# Altium project VENTUNOQ.PrjPcb (part 9 of 18)

## Sheet POWER_DCDC_SOM.SchDoc: POWER DCDC SOM
size A3; Author: Silvio Navaretti; CompanyName: ARDUINO; DrawnBy: Silvio Navaretti; Engineer: Silvio Navaretti; Organization: ARDUINO; SheetNumber: 39; SheetTotal: 51; RevAuthor: Silvio Navaretti
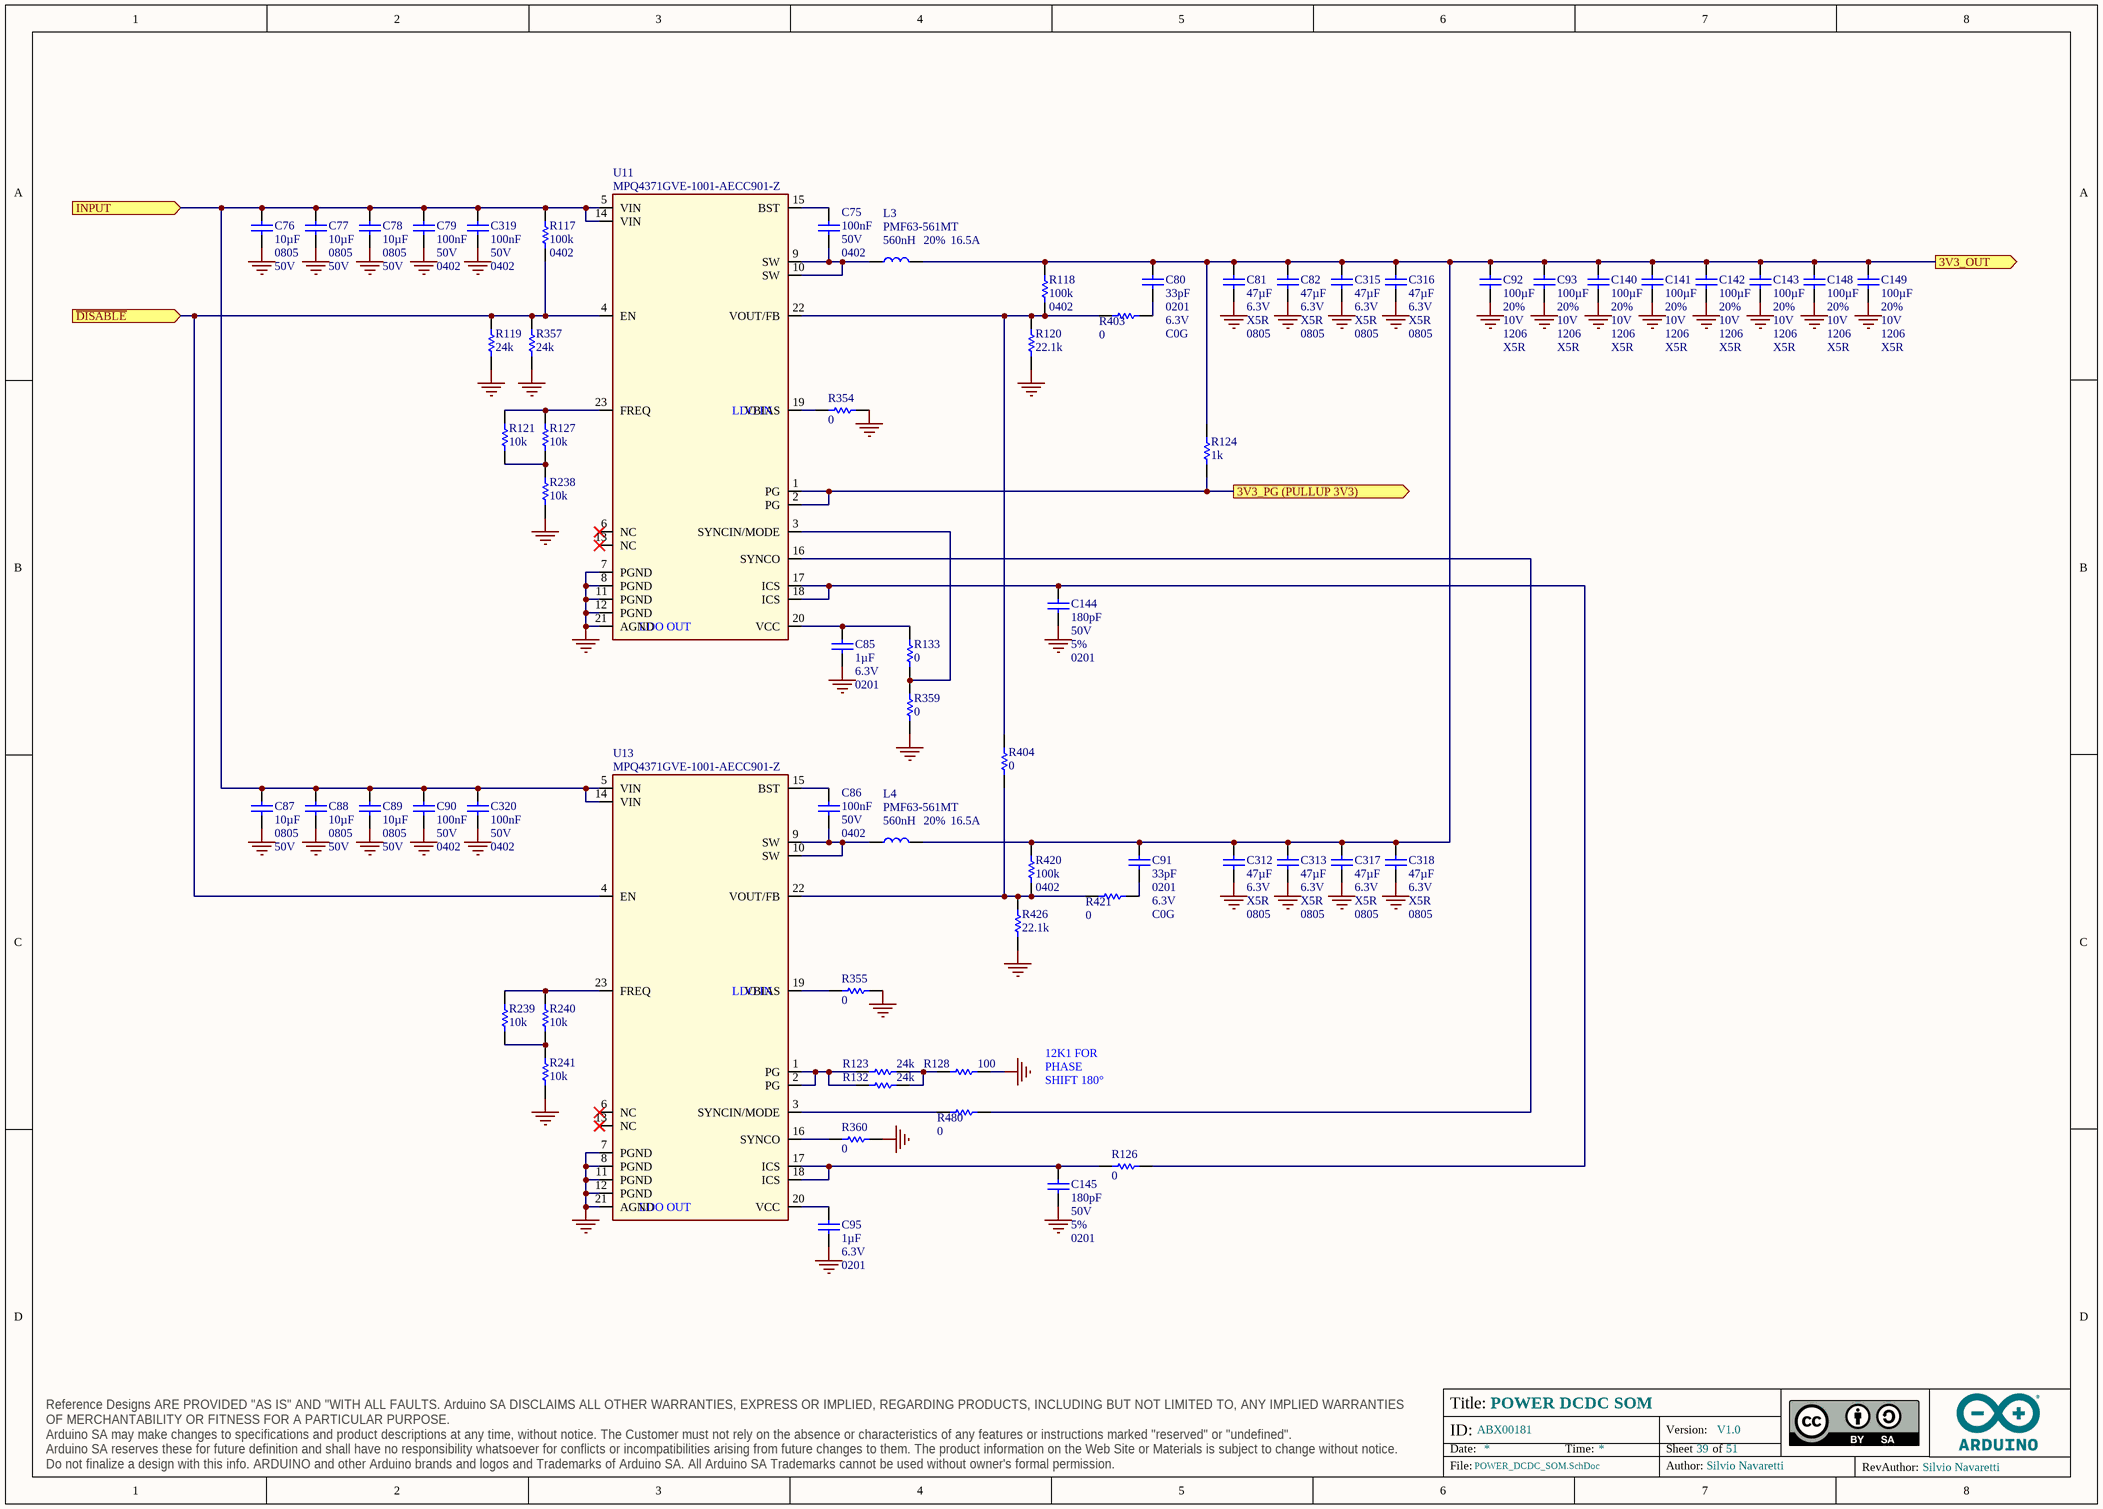
[diagram p23: POWER_DCDC_SOM.SchDoc]

### Parts
C75  value 100nF  Voltage: 50V  Case Code (Imperial): 0402  [CAP-0402]  (hidden comment: GRM155R61H104KE19D)
C76  value 10µF  Case Code (Imperial): 0805  Voltage: 50V  [CAP-0805]  (hidden comment: GRM21BR61H106ME43L)
C77  value 10µF  Case Code (Imperial): 0805  Voltage: 50V  [CAP-0805]  (hidden comment: GRM21BR61H106ME43L)
C78  value 10µF  Case Code (Imperial): 0805  Voltage: 50V  [CAP-0805]  (hidden comment: GRM21BR61H106ME43L)
C79  value 100nF  Voltage: 50V  Case Code (Imperial): 0402  [CAP-0402]  (hidden comment: GRM155R61H104KE19D)
C80  value 33pF  Case Code (Imperial): 0201  Voltage: 6.3V  Dielectric: C0G  [CAP-0201]  (hidden comment: GJM0335C0J330JB01J)
C81  value 47µF  Voltage: 6.3V  Dielectric: X5R  Case Code (Imperial): 0805  [CAP-0805]  (hidden comment: C0805C476M9PAC7800)
C82  value 47µF  Voltage: 6.3V  Dielectric: X5R  Case Code (Imperial): 0805  [CAP-0805]  (hidden comment: C0805C476M9PAC7800)
C85  value 1µF  Voltage: 6.3V  Case Code (Imperial): 0201  [CAP-0201]  (hidden comment: GRM033R60J105MEA2D)
C86  value 100nF  Voltage: 50V  Case Code (Imperial): 0402  [CAP-0402]  (hidden comment: GRM155R61H104KE19D)
C87  value 10µF  Case Code (Imperial): 0805  Voltage: 50V  [CAP-0805]  (hidden comment: GRM21BR61H106ME43L)
C88  value 10µF  Case Code (Imperial): 0805  Voltage: 50V  [CAP-0805]  (hidden comment: GRM21BR61H106ME43L)
C89  value 10µF  Case Code (Imperial): 0805  Voltage: 50V  [CAP-0805]  (hidden comment: GRM21BR61H106ME43L)
C90  value 100nF  Voltage: 50V  Case Code (Imperial): 0402  [CAP-0402]  (hidden comment: GRM155R61H104KE19D)
C91  value 33pF  Case Code (Imperial): 0201  Voltage: 6.3V  Dielectric: C0G  [CAP-0201]  (hidden comment: GJM0335C0J330JB01J)
C92  value 100µF  Tolerance: 20%  Voltage: 10V  Case Code (Imperial): 1206  Dielectric: X5R  [CAP-1206]  (hidden comment: GRM31CR61A107MEA8L)
C93  value 100µF  Tolerance: 20%  Voltage: 10V  Case Code (Imperial): 1206  Dielectric: X5R  [CAP-1206]  (hidden comment: GRM31CR61A107MEA8L)
C95  value 1µF  Voltage: 6.3V  Case Code (Imperial): 0201  [CAP-0201]  (hidden comment: GRM033R60J105MEA2D)
C140  value 100µF  Tolerance: 20%  Voltage: 10V  Case Code (Imperial): 1206  Dielectric: X5R  [CAP-1206]  (hidden comment: GRM31CR61A107MEA8L)
C141  value 100µF  Tolerance: 20%  Voltage: 10V  Case Code (Imperial): 1206  Dielectric: X5R  [CAP-1206]  (hidden comment: GRM31CR61A107MEA8L)
C142  value 100µF  Tolerance: 20%  Voltage: 10V  Case Code (Imperial): 1206  Dielectric: X5R  [CAP-1206]  (hidden comment: GRM31CR61A107MEA8L)
C143  value 100µF  Tolerance: 20%  Voltage: 10V  Case Code (Imperial): 1206  Dielectric: X5R  [CAP-1206]  (hidden comment: GRM31CR61A107MEA8L)
C144  value 180pF  Voltage: 50V  Tolerance: 5%  Case Code (Imperial): 0201  [CAP-0201]  (hidden comment: GRM0335C1H181JA01D)
C145  value 180pF  Voltage: 50V  Tolerance: 5%  Case Code (Imperial): 0201  [CAP-0201]  (hidden comment: GRM0335C1H181JA01D)
C148  value 100µF  Tolerance: 20%  Voltage: 10V  Case Code (Imperial): 1206  Dielectric: X5R  [CAP-1206]  (hidden comment: GRM31CR61A107MEA8L)
C149  value 100µF  Tolerance: 20%  Voltage: 10V  Case Code (Imperial): 1206  Dielectric: X5R  [CAP-1206]  (hidden comment: GRM31CR61A107MEA8L)
C312  value 47µF  Voltage: 6.3V  Dielectric: X5R  Case Code (Imperial): 0805  [CAP-0805]  (hidden comment: C0805C476M9PAC7800)
C313  value 47µF  Voltage: 6.3V  Dielectric: X5R  Case Code (Imperial): 0805  [CAP-0805]  (hidden comment: C0805C476M9PAC7800)
C315  value 47µF  Voltage: 6.3V  Dielectric: X5R  Case Code (Imperial): 0805  [CAP-0805]  (hidden comment: C0805C476M9PAC7800)
C316  value 47µF  Voltage: 6.3V  Dielectric: X5R  Case Code (Imperial): 0805  [CAP-0805]  (hidden comment: C0805C476M9PAC7800)
C317  value 47µF  Voltage: 6.3V  Dielectric: X5R  Case Code (Imperial): 0805  [CAP-0805]  (hidden comment: C0805C476M9PAC7800)
C318  value 47µF  Voltage: 6.3V  Dielectric: X5R  Case Code (Imperial): 0805  [CAP-0805]  (hidden comment: C0805C476M9PAC7800)
C319  value 100nF  Voltage: 50V  Case Code (Imperial): 0402  [CAP-0402]  (hidden comment: GRM155R61H104KE19D)
C320  value 100nF  Voltage: 50V  Case Code (Imperial): 0402  [CAP-0402]  (hidden comment: GRM155R61H104KE19D)
L3  PMF63-561MT  Inductance: 560nH  IRMS: 16.5A  Tolerance: 20%  [PMF63]
L4  PMF63-561MT  Inductance: 560nH  IRMS: 16.5A  Tolerance: 20%  [PMF63]
R117  value 100k  Case Code (Imperial): 0402  [RES-0402]  (hidden comment: CRCW0402100KFKEDC)
R118  value 100k  Case Code (Imperial): 0402  [RES-0402]  (hidden comment: CRCW0402100KFKEDC)
R119  value 24k  [RES-0201]  (hidden comment: RC0201FR-0724KL)
R120  value 22.1k  [RES-0201]  (hidden comment: RC0201FR-0722K1L)
R121  value 10k  [RES-0201]  (hidden comment: RC0201FR-0710KL)
R123  value 24k  [RES-0201]  (hidden comment: RC0201FR-0724KL)
R124  value 1k  [RES-0201]  (hidden comment: RC0201FR-071KL)
R126  value 0  [RES-0201]  (hidden comment: CRCW02010000Z0ED)
R127  value 10k  [RES-0201]  (hidden comment: RC0201FR-0710KL)
R128  value 100  [RES-0201]  (hidden comment: RC0201FR-07100RL)
R132  value 24k  [RES-0201]  (hidden comment: RC0201FR-0724KL)
R133  value 0  [RES-0201]  (hidden comment: CRCW02010000Z0ED)
R238  value 10k  [RES-0201]  (hidden comment: RC0201FR-0710KL)
R239  value 10k  [RES-0201]  (hidden comment: RC0201FR-0710KL)
R240  value 10k  [RES-0201]  (hidden comment: RC0201FR-0710KL)
R241  value 10k  [RES-0201]  (hidden comment: RC0201FR-0710KL)
R354  value 0  [RES-0201]  (hidden comment: CRCW02010000Z0ED)
R355  value 0  [RES-0201]  (hidden comment: CRCW02010000Z0ED)
R357  value 24k  [RES-0201]  (hidden comment: RC0201FR-0724KL)
R359  value 0  [RES-0201]  (hidden comment: CRCW02010000Z0ED)
R360  value 0  [RES-0201]  (hidden comment: CRCW02010000Z0ED)
R403  value 0  [RES-0201]  (hidden comment: CRCW02010000Z0ED)
R404  value 0  [RES-0201]  (hidden comment: CRCW02010000Z0ED)
R420  value 100k  Case Code (Imperial): 0402  [RES-0402]  (hidden comment: CRCW0402100KFKEDC)
R421  value 0  [RES-0201]  (hidden comment: CRCW02010000Z0ED)
R426  value 22.1k  [RES-0201]  (hidden comment: RC0201FR-0722K1L)
R480  value 0  [RES-0201]  (hidden comment: CRCW02010000Z0ED)
U11  MPQ4371GVE-1001-AECC901-Z  [MPQ4371GVE-1001-AECC901-Z]
U13  MPQ4371GVE-1001-AECC901-Z  [MPQ4371GVE-1001-AECC901-Z]

### Ports
3V3_OUT (out), 3V3_PG (PULLUP 3V3) (out), INPUT (in), ~{DISABLE} (in)

### Nets
+3V3: C80.2 C81.2 C82.2 C91.2 C92.1 C93.1 C140.1 C141.1 C142.1 C143.1 C148.1 C149.1 C312.2 C313.2 C315.2 C316.2 C317.2 C318.2 L3.2 L4.2 R118.1 R124.1 R420.1 ; port 3V3_OUT
GND: C76.2 C77.2 C78.2 C79.2 C81.1 C82.1 C85.1 C87.2 C88.2 C89.2 C90.2 C92.2 C93.2 C95.1 C140.2 C141.2 C142.2 C143.2 C144.1 C145.1 C148.2 C149.2 C312.1 C313.1 C315.1 C316.1 C317.1 C318.1 C319.2 C320.2 R119.1 R120.1 R128.2 R238.1 R241.1 R354.1 R355.1 R357.1 R359.1 R360.1 R426.1 U11.7(PGND) U11.8(PGND) U11.11(PGND) U11.12(PGND) U11.21(AGND) U13.7(PGND) U13.8(PGND) U13.11(PGND) U13.12(PGND) U13.21(AGND)
3V3_PG (PULLUP 3V3): R124.2 U11.1(PG) U11.2(PG) ; port 3V3_PG (PULLUP 3V3)
~{POWER_DISABLE_7-24V}: R117.2 R119.2 R357.2 U11.4(EN) U13.4(EN) ; port ~{DISABLE}
NetC75_1: C75.1 U11.15(BST)
NetC75_2: C75.2 L3.1 U11.9(SW) U11.10(SW)
NetC76_1: C76.1 C77.1 C78.1 C79.1 C87.1 C88.1 C89.1 C90.1 C319.1 C320.1 R117.1 U11.5(VIN) U11.14(VIN) U13.5(VIN) U13.14(VIN) ; port INPUT
NetC80_1: C80.1 R403.2
NetC85_2: C85.2 R133.2 U11.20(VCC)
NetC86_1: C86.1 U13.15(BST)
NetC86_2: C86.2 L4.1 U13.9(SW) U13.10(SW)
NetC91_1: C91.1 R421.2
NetC95_2: C95.2 U13.20(VCC)
NetC144_2: C144.2 R126.1 U11.17(ICS) U11.18(ICS)
NetC145_2: C145.2 R126.2 U13.17(ICS) U13.18(ICS)
NetR118_2: R118.2 R120.2 R403.1 R404.1 U11.22(VOUT/FB)
NetR121_1: R121.1 R127.1 R238.2
NetR121_2: R121.2 R127.2 U11.23(FREQ)
NetR123_1: R123.1 R128.1 R132.1
NetR123_2: R123.2 R132.2 U13.1(PG) U13.2(PG)
NetR133_1: R133.1 R359.2 U11.3(SYNCIN/MODE)
NetR239_1: R239.1 R240.1 R241.2
NetR239_2: R239.2 R240.2 U13.23(FREQ)
NetR354_2: R354.2 U11.19(VBIAS)
NetR355_2: R355.2 U13.19(VBIAS)
NetR360_2: R360.2 U13.16(SYNCO)
NetR404_2: R404.2 R420.2 R421.1 R426.2 U13.22(VOUT/FB)
NetR480_1: R480.1 U13.3(SYNCIN/MODE)
NetR480_2: R480.2 U11.16(SYNCO)

Not connected (* = marked no-connect by the designer): U11 6(NC)* 13(NC)*; U13 6(NC)* 13(NC)*

### Notes on the sheet
- 12K1 FOR PHASE SHIFT 180°
- Title:
- ID:
- Date:
- Time:
- Version:
- Sheet
- of
- RevAuthor:
- Reference Designs ARE PROVIDED "AS IS" AND "WITH ALL FAULTS. Arduino SA DISCLAIMS ALL OTHER WARRANTIES, EXPRESS OR IMPLIED, REGARDING PRODUCTS, INCLUDING BUT NOT LIMITED TO, ANY IMPLIED WARRANTIES OF MERCHANTABILITY OR FITNESS FOR A PARTICULAR PURPOSE.
  Arduino SA may make changes to specifications and product descriptions at any time, without notice. The Customer must not rely on the absence or characteristics of any features or instructions marked "reserved" or "undefined".
  Arduino SA reserves these for future definition and shall have no responsibility whatsoever for conflicts or incompatibilities arising from future changes to them. The product information on the Web Site or Materials is subject to change without notice.
  Do not finalize a design with this info. ARDUINO and other Arduino brands and logos and Trademarks of Arduino SA. All Arduino SA Trademarks cannot be used without owner's formal permission.
- File:
- Author:
- (in symbol U0503-A.7) LDO IN; LDO OUT

### Library data of the parts
C75 C79 C86 C90 C319 C320 = C0015-A.14: as C301 on sheet POWER; Part Number: GRM155R61H104KE19D; Dielectric: X5R; Tolerance: 10%; Technology: Ceramic
C76-C78 C87-C89 = C0158-A.3: as C73 on sheet ETH_PHY; Tolerance: 20%; Dielectric: X5R; Technology: SMD; Part Number: GRM21BR61H106ME43L
C80 C91 = C0114-A.6: CAP CHIP 0201 33pF 5% 6.3V C0G; Manufacturer: Murata Electronics; Code Arduino: C0114; Technology: Ceramic; Tolerance: 5%; Part Number: GJM0335C0J330JB01J
C81 C82 C312 C313 C315-C318 = C0199-A.1: as C221 on sheet POWER; Technology: Ceramic; Tolerance: 20%; Part Number: C0805C476M9PAC7800
C85 C95 = C0002-A.15: as C9 on sheet ETH_PHY; Tolerance: 20%; Dielectric: X5R; Part Number: GRM033R60J105MEA2D; Technology: Ceramic
C92 C93 C140-C143 C148 C149 = C0166-A.1: CAP CHIP 1206 100uF 20% 10V X5R; Manufacturer: Murata; Code Arduino: C0166; Datasheet: https://www.mouser.it/datasheet/2/281/1/GRM31CR61A107MEA8_01A-1987899.pdf; Technology: Thick film; Part Number: GRM31CR61A107MEA8L
C144 C145 = C0198-A.1: CAP CHIP 0201 180pF 5% 50V C0G; Manufacturer: Murata; Code Arduino: C0198; Technology: Ceramic; Dielectric: C0G; Part Number: GRM0335C1H181JA01D
L3 L4 = I0124-A.1: IND 0.56uH 20%, max 5mR, IRMS 16.5A, Isat 25.5A, 7.3x6.6x3mm; Manufacturer: K-WELL; Code Arduino: I0124; DCR max: 5m; ISAT: 25.5A; Part Number: PMF63-561MT; Case Code (Metric): 7.3x6.6x3mm; Max Operating Temperature: 125°C; ComponentLink1URL: http://www.kw-magnetics.com/index.php?m=content&c=index&a=show&catid=162&id=294
R117 R118 R420 = R0001-A.24: as R230 on sheet POWER; Tolerance: 1%; Part Number: CRCW0402100KFKEDC; Technology: Thick film
R119 R123 R132 R357 = R0398-A.1: as R248 on sheet POWER; Technology: Thick film; Tolerance: 1%; Case Code (Imperial): 0201; Part Number: RC0201FR-0724KL
R120 R426 = R0396-A.1: RES CHIP 0201 22k1 1% 1/20W; Manufacturer: YAGEO; Code Arduino: R0396; Temperature Coefficient: 200ppm; Power: 50mW; Part Number: RC0201FR-0722K1L; Tolerance: 1%; Technology: Thick film; Case Code (Imperial): 0201
R121 R127 R238-R241 = R0145-A.21: as R150 on sheet POWER; Manufacturer 2: Samsung Electro-Mechanics; Tolerance: 1%; Case Code (Imperial): 0201; Part Number: RC0201FR-0710KL; Technology: Thick film
R124 = R0195-A.22: RES CHIP 0201 1k 1% 1/20W; Manufacturer: Yageo; Power: 50mW; Temperature coefficient: 200ppm; Code Arduino: R0195; Tolerance: 1%; Case Code (Imperial): 0201; Part Number: RC0201FR-071KL; Technology: Thick film
R126 R133 R354 R355 R359 R360 R403 R404 R421 R480 = R0140-A.21: as R284 on sheet ETH_PHY; Technology: Thick film; Case Code (Imperial): 0201; Part Number: CRCW02010000Z0ED
R128 = R0235-A.13: RES CHIP 0201 100R 1% 1/20W; Manufacturer: YAGEO; Power: 50mW; Temperature coefficient: 200ppm; Code Arduino: R0235; Tolerance: 1%; Case Code (Imperial): 0201; Technology: Thick film; Part Number: RC0201FR-07100RL
U11 U13 = U0503-A.7: IC Buck Vin 36V, Vout ADJ, Iout max 11A, with FSS, multi phase, QFN23 4x5mm; Manufacturer: MPS; Code Arduino: U0503; Part Number: MPQ4371GVE-1001-AECC901-Z

## Sheet POWER_REGULATORS_CARRIER.SchDoc: POWER REGULATORS
size A3; Author: Silvio Navaretti; CompanyName: ARDUINO; DrawnBy: Silvio Navaretti; Engineer: Silvio Navaretti; Organization: ARDUINO; SheetNumber: 40; SheetTotal: 51; RevAuthor: Silvio Navaretti
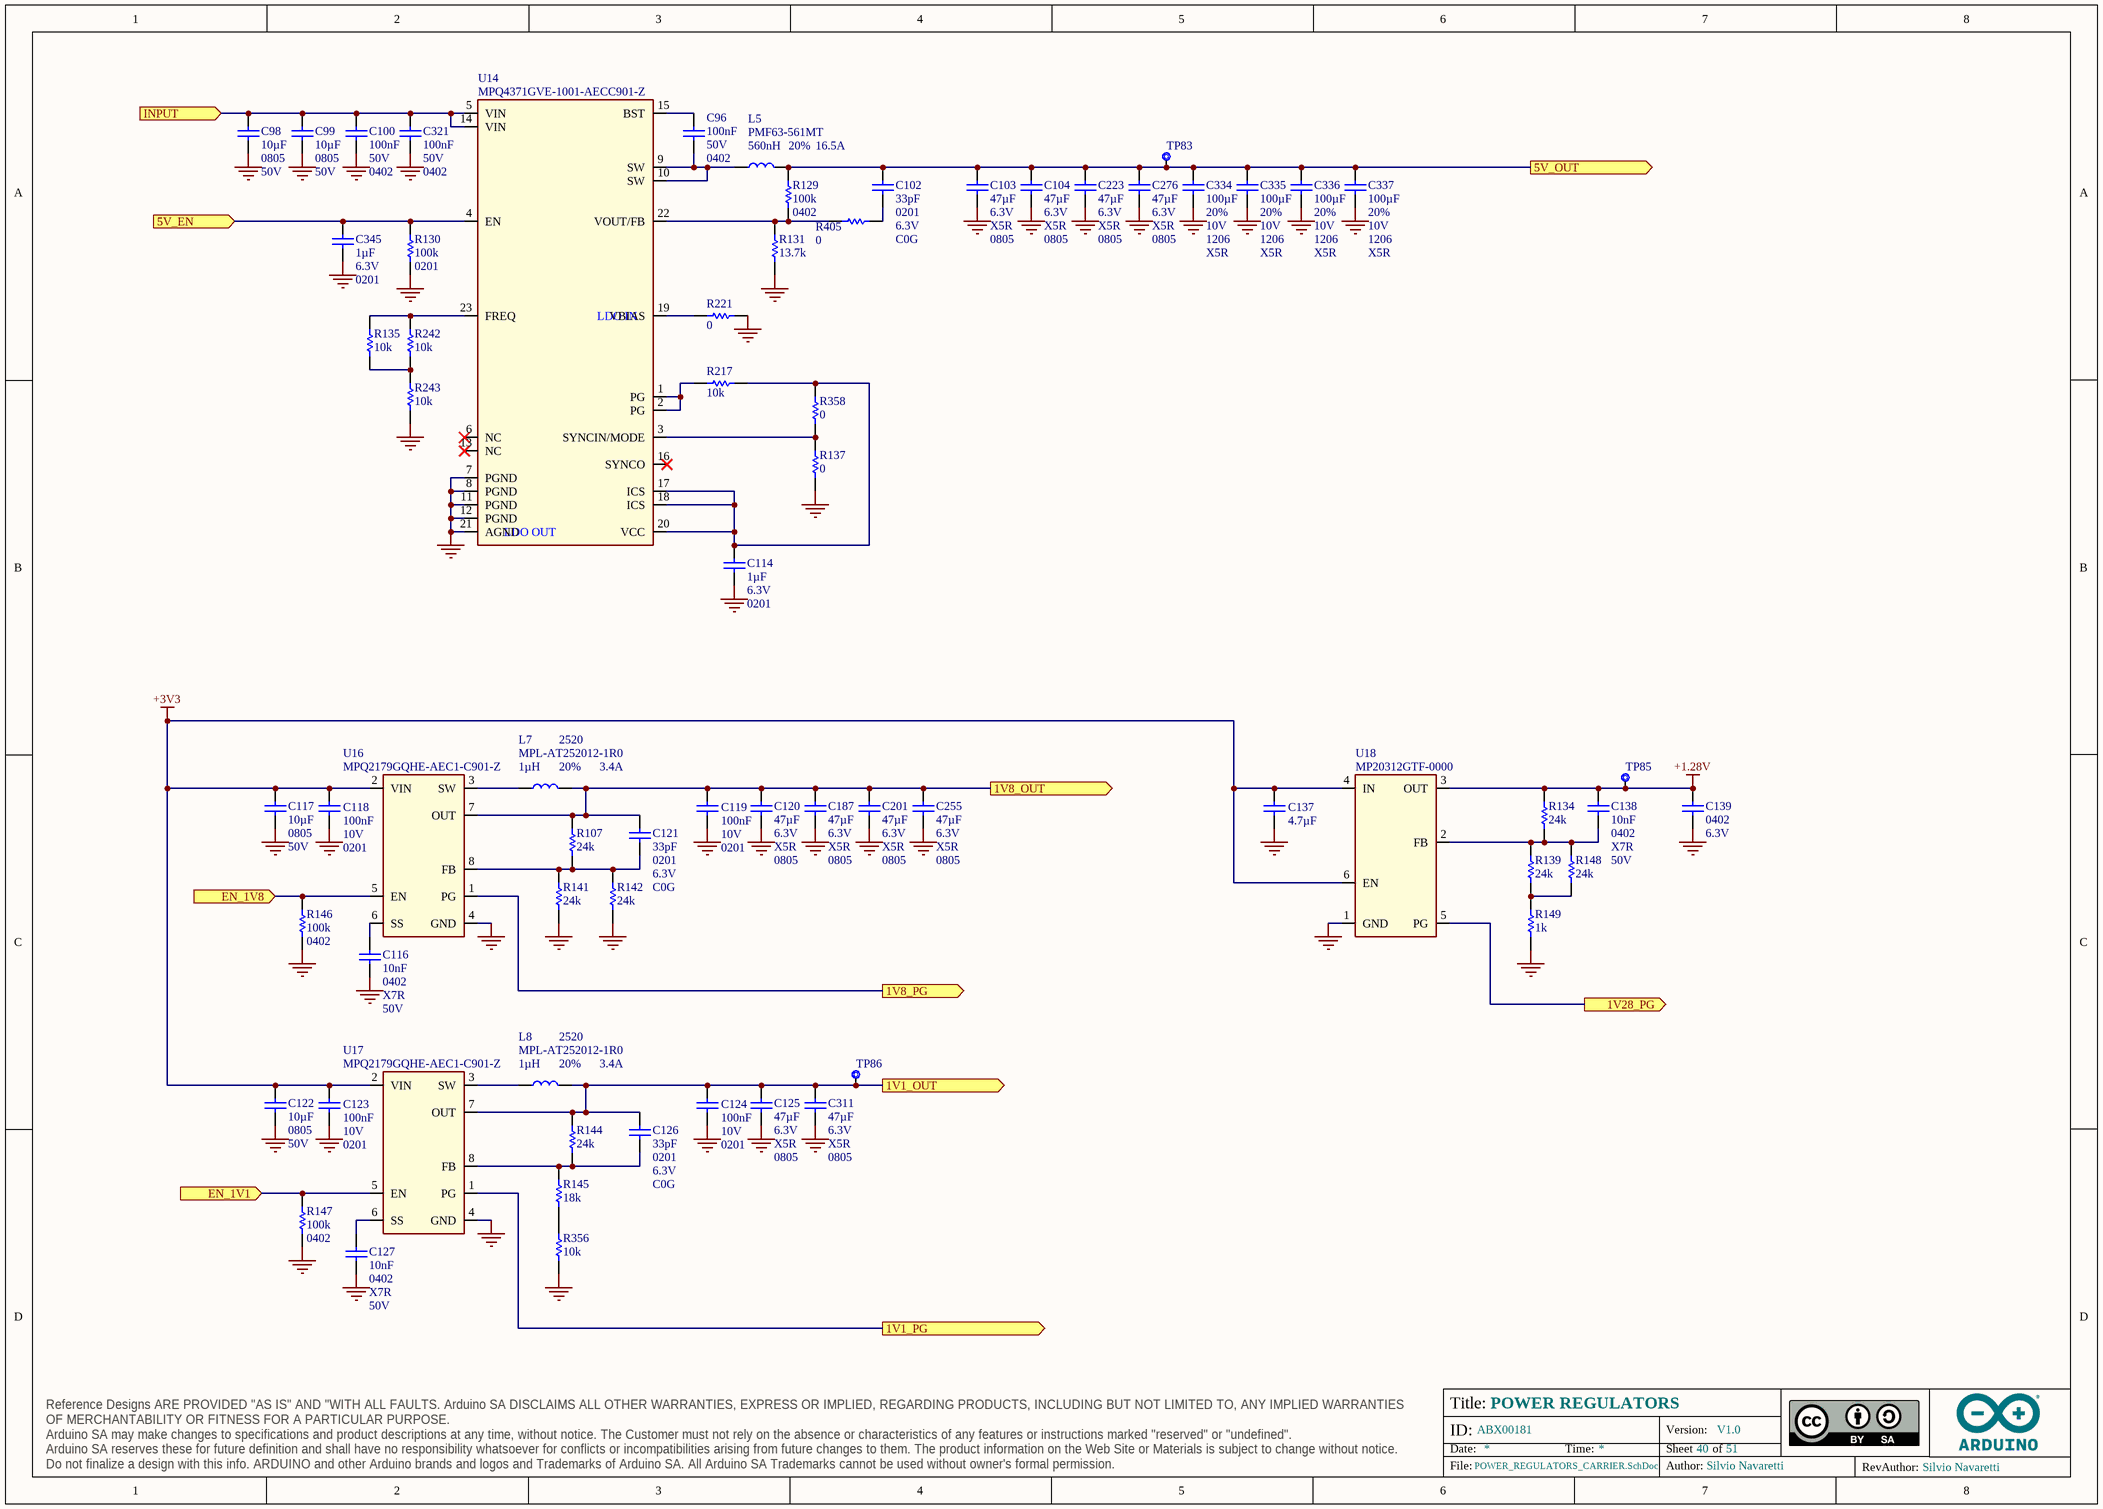
[diagram p24: POWER_REGULATORS_CARRIER.SchDoc]

### Parts
C96  value 100nF  Voltage: 50V  Case Code (Imperial): 0402  [CAP-0402]  (hidden comment: GRM155R61H104KE19D)
C98  value 10µF  Case Code (Imperial): 0805  Voltage: 50V  [CAP-0805]  (hidden comment: GRM21BR61H106ME43L)
C99  value 10µF  Case Code (Imperial): 0805  Voltage: 50V  [CAP-0805]  (hidden comment: GRM21BR61H106ME43L)
C100  value 100nF  Voltage: 50V  Case Code (Imperial): 0402  [CAP-0402]  (hidden comment: GRM155R61H104KE19D)
C102  value 33pF  Case Code (Imperial): 0201  Voltage: 6.3V  Dielectric: C0G  [CAP-0201]  (hidden comment: GJM0335C0J330JB01J)
C103  value 47µF  Voltage: 6.3V  Dielectric: X5R  Case Code (Imperial): 0805  [CAP-0805]  (hidden comment: C0805C476M9PAC7800)
C104  value 47µF  Voltage: 6.3V  Dielectric: X5R  Case Code (Imperial): 0805  [CAP-0805]  (hidden comment: C0805C476M9PAC7800)
C114  value 1µF  Voltage: 6.3V  Case Code (Imperial): 0201  [CAP-0201]  (hidden comment: GRM033R60J105MEA2D)
C116  value 10nF  Case Code (Imperial): 0402  Dielectric: X7R  Voltage: 50V  [CAP-0402]  (hidden comment: C1005B103K500NT)
C117  value 10µF  Case Code (Imperial): 0805  Voltage: 50V  [CAP-0805]  (hidden comment: GRM21BR61H106ME43L)
C118  value 100nF  Voltage: 10V  Case Code (Imperial): 0201  [CAP-0201]  (hidden comment: CL03A104KP3NNNC)
C119  value 100nF  Voltage: 10V  Case Code (Imperial): 0201  [CAP-0201]  (hidden comment: CL03A104KP3NNNC)
C120  value 47µF  Voltage: 6.3V  Dielectric: X5R  Case Code (Imperial): 0805  [CAP-0805]  (hidden comment: C0805C476M9PAC7800)
C121  value 33pF  Case Code (Imperial): 0201  Voltage: 6.3V  Dielectric: C0G  [CAP-0201]  (hidden comment: GJM0335C0J330JB01J)
C122  value 10µF  Case Code (Imperial): 0805  Voltage: 50V  [CAP-0805]  (hidden comment: GRM21BR61H106ME43L)
C123  value 100nF  Voltage: 10V  Case Code (Imperial): 0201  [CAP-0201]  (hidden comment: CL03A104KP3NNNC)
C124  value 100nF  Voltage: 10V  Case Code (Imperial): 0201  [CAP-0201]  (hidden comment: CL03A104KP3NNNC)
C125  value 47µF  Voltage: 6.3V  Dielectric: X5R  Case Code (Imperial): 0805  [CAP-0805]  (hidden comment: C0805C476M9PAC7800)
C126  value 33pF  Case Code (Imperial): 0201  Voltage: 6.3V  Dielectric: C0G  [CAP-0201]  (hidden comment: GJM0335C0J330JB01J)
C127  value 10nF  Case Code (Imperial): 0402  Dielectric: X7R  Voltage: 50V  [CAP-0402]  (hidden comment: C1005B103K500NT)
C137  value 4.7µF  [CAP-0402]  (hidden comment: C1005A475M6R3NT)
C138  value 10nF  Case Code (Imperial): 0402  Dielectric: X7R  Voltage: 50V  [CAP-0402]  (hidden comment: C1005B103K500NT)
C139  Case Code (Imperial): 0402  Voltage: 6.3V  [CAP-0402]  (hidden comment: C1005A475M6R3NT)
C187  value 47µF  Voltage: 6.3V  Dielectric: X5R  Case Code (Imperial): 0805  [CAP-0805]  (hidden comment: C0805C476M9PAC7800)
C201  value 47µF  Voltage: 6.3V  Dielectric: X5R  Case Code (Imperial): 0805  [CAP-0805]  (hidden comment: C0805C476M9PAC7800)
C223  value 47µF  Voltage: 6.3V  Dielectric: X5R  Case Code (Imperial): 0805  [CAP-0805]  (hidden comment: C0805C476M9PAC7800)
C255  value 47µF  Voltage: 6.3V  Dielectric: X5R  Case Code (Imperial): 0805  [CAP-0805]  (hidden comment: C0805C476M9PAC7800)
C276  value 47µF  Voltage: 6.3V  Dielectric: X5R  Case Code (Imperial): 0805  [CAP-0805]  (hidden comment: C0805C476M9PAC7800)
C311  value 47µF  Voltage: 6.3V  Dielectric: X5R  Case Code (Imperial): 0805  [CAP-0805]  (hidden comment: C0805C476M9PAC7800)
C321  value 100nF  Voltage: 50V  Case Code (Imperial): 0402  [CAP-0402]  (hidden comment: GRM155R61H104KE19D)
C334  value 100µF  Tolerance: 20%  Voltage: 10V  Case Code (Imperial): 1206  Dielectric: X5R  [CAP-1206]  (hidden comment: GRM31CR61A107MEA8L)
C335  value 100µF  Tolerance: 20%  Voltage: 10V  Case Code (Imperial): 1206  Dielectric: X5R  [CAP-1206]  (hidden comment: GRM31CR61A107MEA8L)
C336  value 100µF  Tolerance: 20%  Voltage: 10V  Case Code (Imperial): 1206  Dielectric: X5R  [CAP-1206]  (hidden comment: GRM31CR61A107MEA8L)
C337  value 100µF  Tolerance: 20%  Voltage: 10V  Case Code (Imperial): 1206  Dielectric: X5R  [CAP-1206]  (hidden comment: GRM31CR61A107MEA8L)
C345  value 1µF  Voltage: 6.3V  Case Code (Imperial): 0201  [CAP-0201]  (hidden comment: GRM033R60J105MEA2D)
L5  PMF63-561MT  Inductance: 560nH  IRMS: 16.5A  Tolerance: 20%  [PMF63]
L7  MPL-AT252012-1R0  Tolerance: 20%  Case Code (Metric): 2520  Inductance: 1µH  IRMS: 3.4A  [INDUCTOR 2520]
L8  MPL-AT252012-1R0  Tolerance: 20%  Case Code (Metric): 2520  Inductance: 1µH  IRMS: 3.4A  [INDUCTOR 2520]
R107  value 24k  [RES-0201]  (hidden comment: RC0201FR-0724KL)
R129  value 100k  Case Code (Imperial): 0402  [RES-0402]  (hidden comment: CRCW0402100KFKEDC)
R130  value 100k  Case Code (Imperial): 0201  [RES-0201]  (hidden comment: RC0201FR-07100KL)
R131  value 13.7k  [RES-0201]  (hidden comment: RC0201FR-0713K7L)
R134  value 24k  [RES-0201]  (hidden comment: RC0201FR-0724KL)
R135  value 10k  [RES-0201]  (hidden comment: RC0201FR-0710KL)
R137  value 0  [RES-0201]  (hidden comment: CRCW02010000Z0ED)
R139  value 24k  [RES-0201]  (hidden comment: RC0201FR-0724KL)
R141  value 24k  [RES-0201]  (hidden comment: RC0201FR-0724KL)
R142  value 24k  [RES-0201]  (hidden comment: RC0201FR-0724KL)
R144  value 24k  [RES-0201]  (hidden comment: RC0201FR-0724KL)
R145  value 18k  [RES-0201]  (hidden comment: RC0201FR-0718KL)
R146  value 100k  Case Code (Imperial): 0402  [RES-0402]  (hidden comment: CRCW0402100KFKEDC)
R147  value 100k  Case Code (Imperial): 0402  [RES-0402]  (hidden comment: CRCW0402100KFKEDC)
R148  value 24k  [RES-0201]  (hidden comment: RC0201FR-0724KL)
R149  value 1k  [RES-0201]  (hidden comment: RC0201FR-071KL)
R217  value 10k  [RES-0201]  (hidden comment: RC0201FR-0710KL)
R221  value 0  [RES-0201]  (hidden comment: CRCW02010000Z0ED)
R242  value 10k  [RES-0201]  (hidden comment: RC0201FR-0710KL)
R243  value 10k  [RES-0201]  (hidden comment: RC0201FR-0710KL)
R356  value 10k  [RES-0201]  (hidden comment: RC0201FR-0710KL)
R358  value 0  [RES-0201]  (hidden comment: CRCW02010000Z0ED)
R405  value 0  [RES-0201]  (hidden comment: CRCW02010000Z0ED)
TP83  Test point 1.00mm  [TP-1.00MM]  (value not drawn)  (no BOM)
TP85  Test point 1.00mm  [TP-1.00MM]  (value not drawn)  (no BOM)
TP86  Test point 1.00mm  [TP-1.00MM]  (value not drawn)  (no BOM)
U14  MPQ4371GVE-1001-AECC901-Z  [MPQ4371GVE-1001-AECC901-Z]
U16  MPQ2179GQHE-AEC1-C901-Z  [MPS QFN8 pitch 0.5mm 1.5x2x1mm]
U17  MPQ2179GQHE-AEC1-C901-Z  [MPS QFN8 pitch 0.5mm 1.5x2x1mm]
U18  MP20312GTF-0000  [SOT563]

### Ports
1V1_OUT (out), 1V1_PG (out), 1V8_OUT (out), 1V8_PG (out), 1V28_PG (out), 5V_EN (in), 5V_OUT (out), EN_1V1 (in), EN_1V8 (in), INPUT (in)

### Nets
+1.28V: C138.1 C139.1 R134.1 TP85.X U18.3(OUT)
+1V1: C124.2 C125.2 C126.2 C311.2 L8.2 R144.2 TP86.X U17.7(OUT) ; port 1V1_OUT
+3V3: C117.2 C118.2 C122.2 C123.2 C137.2 U16.2(VIN) U17.2(VIN) U18.4(IN) U18.6(EN)
+5V: C102.2 C103.2 C104.2 C223.2 C276.2 C334.1 C335.1 C336.1 C337.1 L5.2 R129.1 TP83.X ; port 5V_OUT
GND: C98.2 C99.2 C100.2 C103.1 C104.1 C114.1 C116.2 C117.1 C118.1 C119.1 C120.1 C122.1 C123.1 C124.1 C125.1 C127.2 C137.1 C139.2 C187.1 C201.1 C223.1 C255.1 C276.1 C311.1 C321.2 C334.2 C335.2 C336.2 C337.2 C345.1 R130.2 R131.1 R137.1 R141.1 R142.1 R146.2 R147.2 R149.2 R221.1 R243.1 R356.1 U14.7(PGND) U14.8(PGND) U14.11(PGND) U14.12(PGND) U14.21(AGND) U16.4(GND) U17.4(GND) U18.1(GND)
SOM_VREG_MDPX3_1P8: R146.1 R147.1 U16.5(EN) U17.5(EN) ; port EN_1V8, port EN_1V1
1V05_PG (PULLUP 1V8): U17.1(PG) ; port 1V1_PG
NetC76_1: C98.1 C99.1 C100.1 C321.1 U14.5(VIN) U14.14(VIN) ; port INPUT
NetC96_1: C96.1 U14.15(BST)
NetC96_2: C96.2 L5.1 U14.9(SW) U14.10(SW)
NetC102_1: C102.1 R405.2
NetC114_2: C114.2 R217.1 R358.2 U14.17(ICS) U14.18(ICS) U14.20(VCC)
NetC116_1: C116.1 U16.6(SS)
NetC119_2: C119.2 C120.2 C121.2 C187.2 C201.2 C255.2 L7.2 R107.2 U16.7(OUT) ; port 1V8_OUT
NetC121_1: C121.1 R107.1 R141.2 R142.2 U16.8(FB)
NetC126_1: C126.1 R144.1 R145.2 U17.8(FB)
NetC127_1: C127.1 U17.6(SS)
NetC138_2: C138.2 R134.2 R139.2 R148.2 U18.2(FB)
NetC345_2: C345.2 R130.1 U14.4(EN) ; port 5V_EN
NetL7_1: L7.1 U16.3(SW)
NetL8_1: L8.1 U17.3(SW)
NetR129_2: R129.2 R131.2 R405.1 U14.22(VOUT/FB)
NetR135_1: R135.1 R242.1 R243.2
NetR135_2: R135.2 R242.2 U14.23(FREQ)
NetR137_2: R137.2 R358.1 U14.3(SYNCIN/MODE)
NetR139_1: R139.1 R148.1 R149.1
NetR145_1: R145.1 R356.2
NetR150_2: U16.1(PG) ; port 1V8_PG
NetR217_2: R217.2 U14.1(PG) U14.2(PG)
NetR221_2: R221.2 U14.19(VBIAS)
NetU18_5: U18.5(PG) ; port 1V28_PG

Not connected (* = marked no-connect by the designer): U14 6(NC)* 13(NC)* 16(SYNCO)*

### Notes on the sheet
- Title:
- ID:
- Date:
- Time:
- Version:
- Sheet
- of
- RevAuthor:
- Reference Designs ARE PROVIDED "AS IS" AND "WITH ALL FAULTS. Arduino SA DISCLAIMS ALL OTHER WARRANTIES, EXPRESS OR IMPLIED, REGARDING PRODUCTS, INCLUDING BUT NOT LIMITED TO, ANY IMPLIED WARRANTIES OF MERCHANTABILITY OR FITNESS FOR A PARTICULAR PURPOSE.
  Arduino SA may make changes to specifications and product descriptions at any time, without notice. The Customer must not rely on the absence or characteristics of any features or instructions marked "reserved" or "undefined".
  Arduino SA reserves these for future definition and shall have no responsibility whatsoever for conflicts or incompatibilities arising from future changes to them. The product information on the Web Site or Materials is subject to change without notice.
  Do not finalize a design with this info. ARDUINO and other Arduino brands and logos and Trademarks of Arduino SA. All Arduino SA Trademarks cannot be used without owner's formal permission.
- File:
- Author:
- (in symbol U0503-A.7) LDO IN; LDO OUT

### Library data of the parts
C96 C100 C321 = C0015-A.14: as C301 on sheet POWER; Part Number: GRM155R61H104KE19D; Dielectric: X5R; Tolerance: 10%; Technology: Ceramic
C98 C99 C117 C122 = C0158-A.3: as C73 on sheet ETH_PHY; Tolerance: 20%; Dielectric: X5R; Technology: SMD; Part Number: GRM21BR61H106ME43L
C102 C121 C126 = C0114-A.6: as C80 on sheet POWER_DCDC_SOM; Technology: Ceramic; Tolerance: 5%; Part Number: GJM0335C0J330JB01J
C103 C104 C120 C125 C187 C201 C223 C255 C276 C311 = C0199-A.1: as C221 on sheet POWER; Technology: Ceramic; Tolerance: 20%; Part Number: C0805C476M9PAC7800
C114 C345 = C0002-A.15: as C9 on sheet ETH_PHY; Tolerance: 20%; Dielectric: X5R; Part Number: GRM033R60J105MEA2D; Technology: Ceramic
C116 C127 C138 = C0009-A.15: CAP CHIP 0402 10nF 10% 50V X7R; Manufacturer: Hottech; Code Arduino: 0165; Manufacturer 2: Murata Electronics; Part Number: C1005B103K500NT; Tolerance: 10%; Part number 2: CC0402KRX7R9BB103; Manufacturer 3: YAGEO; Technology: Ceramic
C118 C119 C123 C124 = C0113-A.6: as C4-C8 on sheet ETH_PHY; Technology: Ceramic; Part Number: CL03A104KP3NNNC; Dielectric: X5R; Tolerance: 10%
C137 = C0037-A.14: CAP CHIP 0402 4.7uF 20% 6V3 X5R; Manufacturer: Hottech; Code Arduino: 0833; Voltage: 6.3V; Dielectric: X5R; Technology: Ceramic; Part Number: C1005A475M6R3NT; Manufacturer 2: Samsung Electro-Mechanics; Case Code (Imperial): 0402; Tolerance: 20%; Manufacturer 3: Murata Electronics; Part number 3: GRM155R60J475ME47D; Part number 2: CL05A475KQ5NRNC
C139 = C0037-A.14: CAP CHIP 0402 4.7uF 20% 6V3 X5R; Manufacturer: Hottech; Value: 4.7µF; Code Arduino: 0833; Dielectric: X5R; Technology: Ceramic; Part Number: C1005A475M6R3NT; Manufacturer 2: Samsung Electro-Mechanics; Tolerance: 20%; Manufacturer 3: Murata Electronics; Part number 3: GRM155R60J475ME47D; Part number 2: CL05A475KQ5NRNC
C334-C337 = C0166-A.1: as C92 on sheet POWER_DCDC_SOM; Datasheet: https://www.mouser.it/datasheet/2/281/1/GRM31CR61A107MEA8_01A-1987899.pdf; Technology: Thick film; Part Number: GRM31CR61A107MEA8L
L5 = I0124-A.1: as L3 on sheet POWER_DCDC_SOM; ISAT: 25.5A; Part Number: PMF63-561MT; Case Code (Metric): 7.3x6.6x3mm; Max Operating Temperature: 125°C; ComponentLink1URL: http://www.kw-magnetics.com/index.php?m=content&c=index&a=show&catid=162&id=294
L7 L8 = I0127-A.3: IND SMD 1uH 20% ISAT 4.5A IRMS 3.4A 55mR MAX 2.5x2.1.2mm; Manufacturer: MPS; DCR max: 55m; Code Arduino: I0127; Resonant frequency: 88MHz; ISAT: 4.5A; Max Operating Temperature: 125°C; Part Number: MPL-AT252012-1R0
R107 R139 R141 R142 R144 R148 = R0398-A.1: as R248 on sheet POWER; Case Code (Imperial): 0201; Part Number: RC0201FR-0724KL; Technology: Thick film; Tolerance: 1%
R129 R146 R147 = R0001-A.24: as R230 on sheet POWER; Tolerance: 1%; Part Number: CRCW0402100KFKEDC; Technology: Thick film
R130 = R0146-A.21: RES CHIP 0201 100k 1% 1/20W; Manufacturer: Yageo; Power: 50mW; Code Arduino: R0146; Temperature coefficient: 200ppm; Tolerance: 1%; Manufacturer 2: Samsung Electro-Mechanics; Part Number: RC0201FR-07100KL; Technology: Thick film
R131 = R0395-A.1: RES CHIP 0201 13k7 1% 1/20W; Manufacturer: YAGEO; Power: 50mW; Temperature Coefficient: 200ppm; Code Arduino: R0395; Technology: Thick film; Case Code (Imperial): 0201; Tolerance: 1%; Part Number: RC0201FR-0713K7L
R134 = R0398-A.1: RES CHIP 0201 24k 1% 1/20W; Manufacturer: YAGEO; Power: 50mW; Temperature Coefficient: 200ppm; Code Arduino: R0398; Tolerance: 1%; Case Code (Imperial): 0201; Part Number: RC0201FR-0724KL; Technology: Thick film
R135 R242 R243 = R0145-A.21: as R150 on sheet POWER; Manufacturer 2: Samsung Electro-Mechanics; Tolerance: 1%; Case Code (Imperial): 0201; Part Number: RC0201FR-0710KL; Technology: Thick film
R137 R221 R358 R405 = R0140-A.21: as R284 on sheet ETH_PHY; Technology: Thick film; Case Code (Imperial): 0201; Part Number: CRCW02010000Z0ED
R145 = R0399-A.1: as R342 on sheet ETH_PHY; Case Code (Imperial): 0201; Part Number: RC0201FR-0718KL; Technology: Thick film; Tolerance: 1%
R149 = R0195-A.22: as R124 on sheet POWER_DCDC_SOM; Part Number: RC0201FR-071KL; Tolerance: 1%; Case Code (Imperial): 0201; Technology: Thick film
R217 = R0145-A.21: RES CHIP 0201 10k 1% 1/20W; Manufacturer: Yageo; Temperature coefficient: 200ppm; Code Arduino: R0145; Power: 50mW; Technology: Thick film; Manufacturer 2: Samsung Electro-Mechanics; Case Code (Imperial): 0201; Part Number: RC0201FR-0710KL; Tolerance: 1%
R356 = R0145-A.21: RES CHIP 0201 10k 1% 1/20W; Manufacturer: Yageo; Power: 50mW; Code Arduino: R0145; Temperature coefficient: 200ppm; Manufacturer 2: Samsung Electro-Mechanics; Case Code (Imperial): 0201; Part Number: RC0201FR-0710KL; Technology: Thick film; Tolerance: 1%
TP83 TP85 TP86 = UT0013-A.6: Part Number: This is not a component; Design Item ID: CMP-018-0005-A.3; Source: ut.SchLib; Manufacturer: This is not a component; Code Arduino: This is not a component; Pin Count: 1
U14 = U0503-A.7: as U11 on sheet POWER_DCDC_SOM; Part Number: MPQ4371GVE-1001-AECC901-Z
U16 U17 = U0504-A.5: IC Buck Vin 5.5V, Vout ADJ, Iout max 3A, fsw 2.4MHz, QFN8 2x1.5mm; Manufacturer: MPS; Code Arduino: U0504; Part Number: MPQ2179GQHE-AEC1-C901-Z
U18 = U0496-A.5: IC LDO, Vin 1.6V - 5.5V, Vout ADJ, Iout 0.5A, SOT563 1.6x1.6mm; Manufacturer: MPS; Code Arduino: U0496; Part Number: MP20312GTF-0000